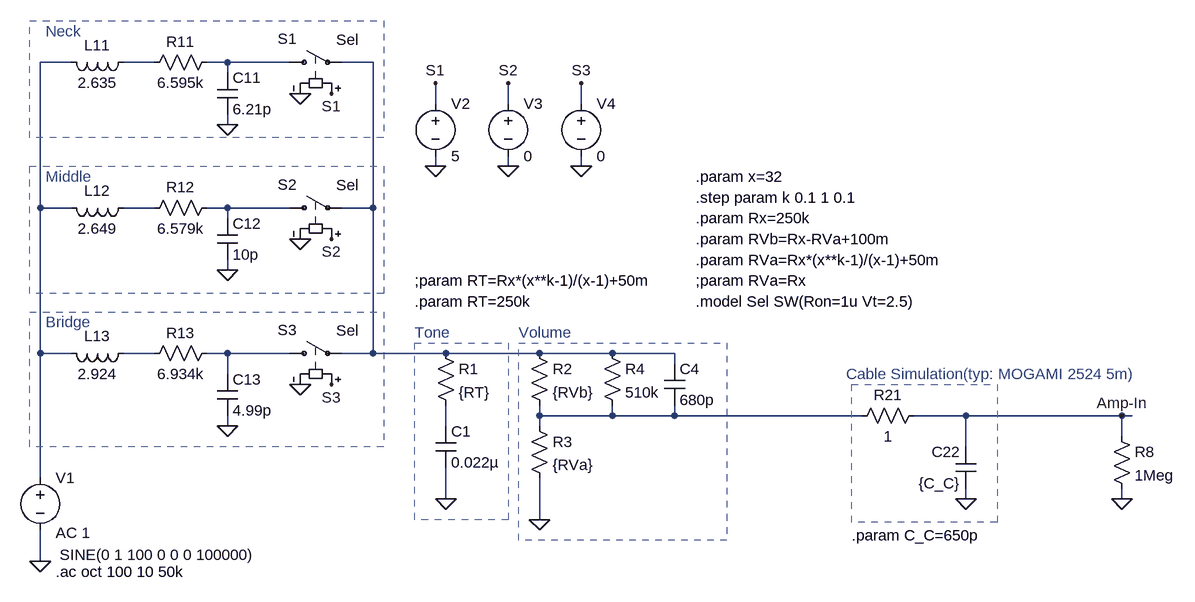
[diagram p0: schematic JWB_Analysis.asc]
JWB_Analysis.asc, the LTspice schematic file:
Version 4.1
SHEET 1 1444 680
WIRE -592 -464 -640 -464
WIRE -464 -464 -512 -464
WIRE -352 -464 -384 -464
WIRE -256 -464 -352 -464
WIRE -128 -464 -176 -464
WIRE -352 -448 -352 -464
WIRE -32 -400 -32 -432
WIRE 80 -400 80 -432
WIRE 192 -400 192 -432
WIRE -352 -368 -352 -384
WIRE -32 -304 -32 -320
WIRE 80 -304 80 -320
WIRE 192 -304 192 -320
WIRE -640 -240 -640 -464
WIRE -592 -240 -640 -240
WIRE -464 -240 -512 -240
WIRE -352 -240 -384 -240
WIRE -256 -240 -352 -240
WIRE -128 -240 -128 -464
WIRE -128 -240 -176 -240
WIRE -352 -224 -352 -240
WIRE -352 -144 -352 -160
WIRE -640 -16 -640 -240
WIRE -592 -16 -640 -16
WIRE -464 -16 -512 -16
WIRE -352 -16 -384 -16
WIRE -256 -16 -352 -16
WIRE -128 -16 -128 -240
WIRE -128 -16 -176 -16
WIRE -16 -16 -128 -16
WIRE 128 -16 -16 -16
WIRE 240 -16 128 -16
WIRE 336 -16 240 -16
WIRE 336 0 336 -16
WIRE -352 16 -352 -16
WIRE 128 80 128 64
WIRE 240 80 240 64
WIRE 240 80 128 80
WIRE 336 80 336 64
WIRE 336 80 240 80
WIRE 624 80 336 80
WIRE 784 80 704 80
WIRE 1024 80 784 80
WIRE 1040 80 1024 80
WIRE -352 96 -352 80
WIRE -16 96 -16 64
WIRE 128 96 128 80
WIRE 1024 112 1024 80
WIRE 784 128 784 80
WIRE -640 176 -640 -16
WIRE -16 208 -16 160
WIRE 784 208 784 192
WIRE 1024 208 1024 192
WIRE 128 240 128 176
WIRE -640 304 -640 256
FLAG -640 304 0
FLAG -16 208 0
FLAG 128 240 0
FLAG 784 208 0
FLAG 1024 80 Amp-In
FLAG 1024 208 0
FLAG -352 96 0
FLAG -352 -144 0
FLAG -352 -368 0
FLAG -240 -416 0
FLAG -240 -192 0
FLAG -240 32 0
FLAG -192 -416 S1
FLAG -192 -192 S2
FLAG -192 32 S3
FLAG -32 -304 0
FLAG -32 -432 S1
FLAG 80 -432 S2
FLAG 192 -432 S3
FLAG 80 -304 0
FLAG 192 -304 0
SYMBOL voltage -640 160 R0
WINDOW 3 30 134 Left 2
WINDOW 123 24 100 Left 2
WINDOW 39 24 72 Left 2
SYMATTR Value SINE(0 1 100 0 0 0 100000)
SYMATTR Value2 AC 1
SYMATTR InstName V1
SYMBOL cap -32 96 R0
SYMATTR InstName C1
SYMATTR Value 0.022µ
SYMBOL res -32 -32 R0
SYMATTR InstName R1
SYMATTR Value {RT}
SYMBOL res 112 -32 R0
SYMATTR InstName R2
SYMATTR Value {RVb}
SYMBOL res 112 80 R0
SYMATTR InstName R3
SYMATTR Value {RVa}
SYMBOL ind -496 -32 R90
WINDOW 0 5 56 VBottom 2
WINDOW 3 32 56 VTop 2
SYMATTR InstName L13
SYMATTR Value 2.924
SYMBOL res -368 -32 R90
WINDOW 0 0 56 VBottom 2
WINDOW 3 32 56 VTop 2
SYMATTR InstName R13
SYMATTR Value 6.934k
SYMBOL res 224 -32 R0
SYMATTR InstName R4
SYMATTR Value 510k
SYMBOL cap 320 0 R0
SYMATTR InstName C4
SYMATTR Value 680p
SYMBOL Res 720 64 R90
WINDOW 0 0 56 VBottom 2
WINDOW 3 32 56 VTop 2
SYMATTR InstName R21
SYMATTR Value 1
SYMBOL Cap 800 192 R180
WINDOW 0 24 56 Left 2
WINDOW 3 24 8 Left 2
SYMATTR InstName C22
SYMATTR Value {C_C}
SYMBOL Res 1008 96 R0
SYMATTR InstName R8
SYMATTR Value 1Meg
SYMBOL res -368 -256 R90
WINDOW 0 0 56 VBottom 2
WINDOW 3 32 56 VTop 2
SYMATTR InstName R12
SYMATTR Value 6.579k
SYMBOL ind -496 -256 R90
WINDOW 0 5 56 VBottom 2
WINDOW 3 32 56 VTop 2
SYMATTR InstName L12
SYMATTR Value 2.649
SYMBOL Cap -368 16 R0
SYMATTR InstName C13
SYMATTR Value 4.99p
SYMBOL Cap -368 -224 R0
SYMATTR InstName C12
SYMATTR Value 10p
SYMBOL res -368 -480 R90
WINDOW 0 0 56 VBottom 2
WINDOW 3 32 56 VTop 2
SYMATTR InstName R11
SYMATTR Value 6.595k
SYMBOL ind -496 -480 R90
WINDOW 0 5 56 VBottom 2
WINDOW 3 32 56 VTop 2
SYMATTR InstName L11
SYMATTR Value 2.635
SYMBOL Cap -368 -448 R0
SYMATTR InstName C11
SYMATTR Value 6.21p
SYMBOL sw -272 -464 R270
WINDOW 0 36 -3 VRight 2
WINDOW 3 35 87 VRight 2
SYMATTR InstName S1
SYMATTR Value Sel
SYMBOL sw -272 -240 R270
WINDOW 0 36 -3 VRight 2
WINDOW 3 35 87 VRight 2
SYMATTR InstName S2
SYMATTR Value Sel
SYMBOL sw -272 -16 R270
WINDOW 0 36 -3 VRight 2
WINDOW 3 35 87 VRight 2
SYMATTR InstName S3
SYMATTR Value Sel
SYMBOL voltage -32 -416 R0
WINDOW 123 0 0 Left 0
WINDOW 39 0 0 Left 0
SYMATTR InstName V2
SYMATTR Value 5
SYMBOL voltage 80 -416 R0
WINDOW 123 0 0 Left 0
WINDOW 39 0 0 Left 0
SYMATTR InstName V3
SYMATTR Value 0
SYMBOL voltage 192 -416 R0
WINDOW 123 0 0 Left 0
WINDOW 39 0 0 Left 0
SYMATTR InstName V4
SYMATTR Value 0
TEXT -616 320 Left 2 !.ac oct 100 10 50k
TEXT 600 16 Left 2 ;Cable Simulation(typ: MOGAMI 2524 5m)
TEXT 368 -288 Left 2 !.param x=32
TEXT 368 -160 Left 2 !.param RVa=Rx*(x**k-1)/(x-1)+50m
TEXT 368 -256 Left 2 !.step param k 0.1 1 0.1
TEXT 368 -224 Left 2 !.param Rx=250k
TEXT 368 -192 Left 2 !.param RVb=Rx-RVa+100m
TEXT -632 -64 Left 2 ;Bridge
TEXT -632 -288 Left 2 ;Middle
TEXT 368 -128 Left 2 !;param RVa=Rx
TEXT 608 264 Left 2 !.param C_C=650p
TEXT -64 -128 Left 2 !;param RT=Rx*(x**k-1)/(x-1)+50m
TEXT -64 -96 Left 2 !.param RT=250k
TEXT -632 -512 Left 2 ;Neck
TEXT 368 -96 Left 2 !.model Sel SW(Ron=1u Vt=2.5)
TEXT -64 -48 Left 2 ;Tone
TEXT 96 -48 Left 2 ;Volume
RECTANGLE Normal -112 -108 -656 -304 2
RECTANGLE Normal -656 -80 -112 128 2
RECTANGLE Normal -64 -32 80 240 2
RECTANGLE Normal 96 -32 416 272 2
RECTANGLE Normal 608 32 832 244 2
RECTANGLE Normal -112 -348 -656 -528 2

The netlist it stands for:
* JWB_Analysis.asc
V1 N001 0 SINE(0 1 100 0 0 0 100000) AC 1
C1 N010 0 0.022µ
R1 N004 N010 {RT}
R2 N004 N009 {RVb}
R3 N009 0 {RVa}
L13 N007 N001 2.924
R13 N008 N007 6.934k
R4 N004 N009 510k
C4 N004 N009 680p
R21 Amp-In N009 1
C22 0 Amp-In {C_C}
R8 Amp-In 0 1Meg
R12 N006 N005 6.579k
L12 N005 N001 2.649
C13 N008 0 4.99p
C12 N006 0 10p
R11 N003 N002 6.595k
L11 N002 N001 2.635
C11 N003 0 6.21p
S1 N003 N004 S1 0 Sel
S2 N006 N004 S2 0 Sel
S3 N008 N004 S3 0 Sel
V2 S1 0 5
V3 S2 0 0
V4 S3 0 0
.ac oct 100 10 50k
* Cable Simulation(typ: MOGAMI 2524 5m)
.param x=32
.param RVa=Rx*(x**k-1)/(x-1)+50m
.step param k 0.1 1 0.1
.param Rx=250k
.param RVb=Rx-RVa+100m
* Bridge
* Middle
;param RVa=Rx
.param C_C=650p
;param RT=Rx*(x**k-1)/(x-1)+50m
.param RT=250k
* Neck
.model Sel SW(Ron=1u Vt=2.5)
* Tone
* Volume
.backanno
.end